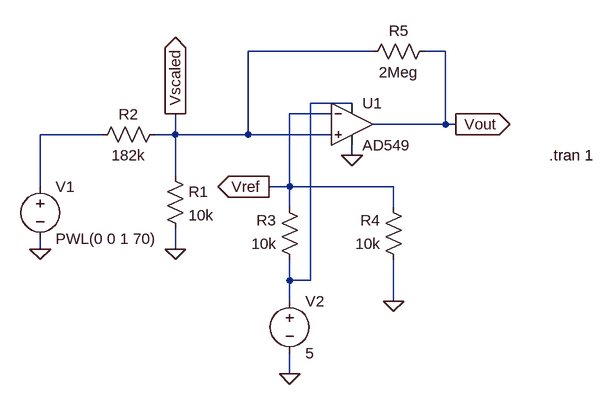
[diagram p0: schematic Hysterisis_threshold.asc]
Hysterisis_threshold.asc, the LTspice schematic file:
Version 4.1
SHEET 1 880 740
WIRE 448 144 256 144
WIRE 560 144 528 144
WIRE 416 224 352 224
WIRE 384 240 320 240
WIRE 560 256 560 144
WIRE 560 256 448 256
WIRE 576 256 560 256
WIRE 32 272 -64 272
WIRE 144 272 144 240
WIRE 144 272 112 272
WIRE 256 272 256 144
WIRE 256 272 144 272
WIRE 384 272 256 272
WIRE 416 304 416 288
WIRE 144 336 144 272
WIRE -64 352 -64 272
WIRE 320 352 320 240
WIRE 320 352 288 352
WIRE 480 352 320 352
WIRE 320 384 320 352
WIRE 480 384 480 352
WIRE -64 448 -64 432
WIRE 144 448 144 416
WIRE 320 496 320 464
WIRE 352 496 352 224
WIRE 352 496 320 496
WIRE 320 528 320 496
WIRE 480 528 480 464
WIRE 320 640 320 608
FLAG 320 640 0
FLAG -64 448 0
FLAG 144 448 0
FLAG 480 528 0
FLAG 576 256 Vout
IOPIN 576 256 Out
FLAG 288 352 Vref
IOPIN 288 352 Out
FLAG 144 240 Vscaled
IOPIN 144 240 Out
FLAG 416 304 0
SYMBOL voltage -64 336 R0
WINDOW 123 0 0 Left 0
WINDOW 39 0 0 Left 0
SYMATTR InstName V1
SYMATTR Value PWL(0 0 1 70)
SYMBOL res 128 320 R0
SYMATTR InstName R1
SYMATTR Value 10k
SYMBOL res 128 256 R90
WINDOW 0 0 56 VBottom 2
WINDOW 3 32 56 VTop 2
SYMATTR InstName R2
SYMATTR Value 182k
SYMBOL res 336 480 R180
WINDOW 0 36 76 Left 2
WINDOW 3 36 40 Left 2
SYMATTR InstName R3
SYMATTR Value 10k
SYMBOL res 496 480 R180
WINDOW 0 36 76 Left 2
WINDOW 3 36 40 Left 2
SYMATTR InstName R4
SYMATTR Value 10k
SYMBOL voltage 320 512 R0
WINDOW 123 0 0 Left 0
WINDOW 39 0 0 Left 0
SYMATTR InstName V2
SYMATTR Value 5
SYMBOL OpAmps\\AD549 416 192 R0
SYMATTR InstName U1
SYMBOL res 544 128 R90
WINDOW 0 0 56 VBottom 2
WINDOW 3 32 56 VTop 2
SYMATTR InstName R5
SYMATTR Value 2Meg
TEXT 720 304 Left 2 !.tran 1

The netlist it stands for:
* Hysterisis_threshold.asc
V1 N002 0 PWL(0 0 1 70)
R1 Vscaled 0 10k
R2 Vscaled N002 182k
R3 N001 Vref 10k
R4 0 Vref 10k
V2 N001 0 5
X§U1 Vscaled Vref N001 0 Vout AD549  ; pins In+ In- V+ V- OUT
R5 Vout Vscaled 2Meg
.tran 1
.backanno
.end